# EAGLE design PENAMPUNG URIN (EAGLE 9.2.0)
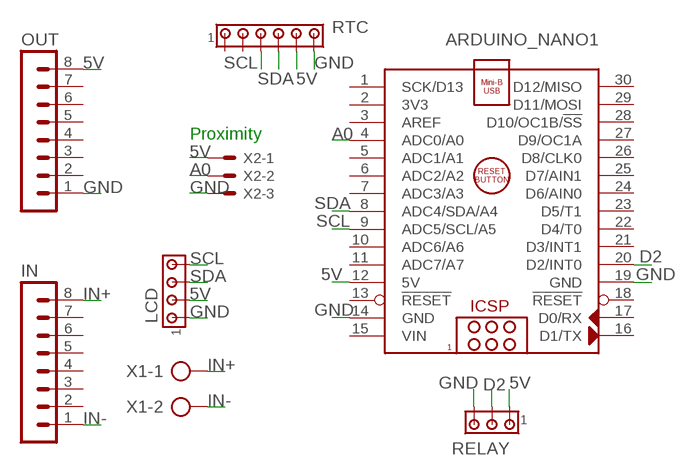
[diagram p0: schematic, sheet 1]

## Parts
ARDUINO_NANO1  ARDUINO_NANO  [ARDUINO_NANO]
IN  MA08-1  [MA08-1]
LCD  MTA04-100  [10X04MTA]
OUT  MA08-1  [MA08-1]
RELAY  MTA03-100  [10X03MTA]
RTC  MTA06-100  [10X06MTA]
X1  AK500/2-H  [AK500/2-H]
X2  KK-156-3  [KK-156-3]

## Nets
5V: ARDUINO_NANO1.12(5V) LCD.2 OUT.8 RELAY.1 RTC.5 X2.1
A0: ARDUINO_NANO1.4(ADC0/A0) X2.2
D2: ARDUINO_NANO1.20(D2/INT0) RELAY.2
GND: ARDUINO_NANO1.14(GND) ARDUINO_NANO1.19(GND) LCD.1 OUT.1 RELAY.3 RTC.6 X2.3
IN+: IN.8 X1.1
IN-: IN.1 X1.2
SCL: ARDUINO_NANO1.9(ADC5/SCL/A5) LCD.4 RTC.3
SDA: ARDUINO_NANO1.8(ADC4/SDA/A4) LCD.3 RTC.4
Unconnected: ARDUINO_NANO1.1(SCK/D13) ARDUINO_NANO1.2(3V3) ARDUINO_NANO1.3(AREF) ARDUINO_NANO1.5(ADC1/A1) ARDUINO_NANO1.6(ADC2/A2) ARDUINO_NANO1.7(ADC3/A3) ARDUINO_NANO1.10(ADC6/A6) ARDUINO_NANO1.11(ADC7/A7) ARDUINO_NANO1.13(!RESET) ARDUINO_NANO1.16(D1/TX) ARDUINO_NANO1.17(D0/RX) ARDUINO_NANO1.18(!RESET) ARDUINO_NANO1.21(D3/INT1) ARDUINO_NANO1.22(D4/T0) ARDUINO_NANO1.23(D5/T1) ARDUINO_NANO1.24(D6/AIN0) ARDUINO_NANO1.25(D7/AIN1) ARDUINO_NANO1.26(D8/CLK0) ARDUINO_NANO1.27(D9/OC1A) ARDUINO_NANO1.28(D10/OC1B/!SS) ARDUINO_NANO1.29(D11/MOSI) ARDUINO_NANO1.30(D12/MISO) IN.2 IN.3 IN.4 IN.5 IN.6 IN.7 OUT.2 OUT.3 OUT.4 OUT.5 OUT.6 OUT.7 RTC.1 RTC.2

## Notes on the sheet
- Proximity

## Power pins joined to a net without a drawn wire
VIN: ARDUINO_NANO1.15(VIN)

## Library data of the parts
ARDUINO_NANO1 = ArduinoNanoV30:ARDUINO_NANO: Arduino Nano V3.0 Module Overview: The Arduino Nano is a small, complete, and breadboard-friendly board based on the ATmega328 (Arduino Nano 3.x) or ATmega168 (Arduino Nano 2.x). It has more or less the same functionality of the Arduino Duemilanove, but in a different package. It lacks only a DC power jack, and works with a Mini-B USB cable instead of a standard one. The Nano was designed and is being produced by Gravitech <http://www.gravitech.us/arna30wiatp.html>. General specifications: Item Value Microcontroller Atmel ATmega168 or ATmega328 Operating Voltage (logic level) 5 V Input Voltage (recommended) 7-12 V Input Voltage (limits) 6-20 V Digital I/O Pins 14 (of which 6 provide PWM output) Analog Input Pins 8 DC Current per I/O Pin 40 mA Flash Memory 16 KB (ATmega168) or 32 KB (ATmega328) of which 2 KB used by bootloader SRAM 1 KB (ATmega168) or 2 KB (ATmega328) EEPROM 512 bytes (ATmega168) or 1 KB (ATmega328) Clock Speed 16 MHz Dimensions (Inches) 0.73" x 1.70" Dimensions (mm) 18mm x 45mm Overall height About 9 mm (not including pins) Weigth 5 g Power: The Arduino Nano can be powered via the Mini-B USB connection, 6-20V unregulated external power supply (pin 30), or 5V regulated external power supply (pin 27). The power source is automatically selected to the highest voltage source. Memory: The ATmega168 has 16 KB of flash memory for storing code (of which 2 KB is used for the bootloader); the ATmega328 has 32 KB, (also with 2 KB used for the bootloader). The ATmega168 has 1 KB of SRAM and 512 bytes of EEPROM (which can be read and written with the EEPROM library); the ATmega328 has 2 KB of SRAM and 1 KB of EEPROM. Input and Output: Each of the 14 digital pins on the Nano can be used as an input or output, using pinMode(), digitalWrite(), and digitalRead() functions. They operate at 5 volts. Each pin can provide or receive a maximum of 40 mA and has an internal pull-up resistor (disconnected by default) of 20-50 kOhms. In addition, some pins have specialized functions. Visit Arduino - ArduinoBoardNano <https://www.arduino.cc/en/Main/ArduinoBoardNano>
IN OUT = con-lstb:MA08-1: PIN HEADER; OC_FARNELL: unknown; OC_NEWARK: unknown
LCD = con-amp:MTA04-100: AMP connector
RELAY = con-amp:MTA03-100: AMP connector
RTC = con-amp:MTA06-100: AMP connector Connection corrected 2014-09-19
X1 = con-ptr500:AK500/2-H: CONNECTOR Aug. 2004 / PTR Meßtechnik: Die Bezeichnung der Serie AK505 wurde geändert. Es handelt sich hierbei um AK500 in horizontaler Ausführung.; OC_FARNELL: unknown; OC_NEWARK: unknown
X2 = con-molex:KK-156-3: KK 156 HEADER Source: http://www.molex.com/pdm_docs/sd/026604100_sd.pdf; MF: MOLEX; OC_FARNELL: unknown; OC_NEWARK: unknown

## Board
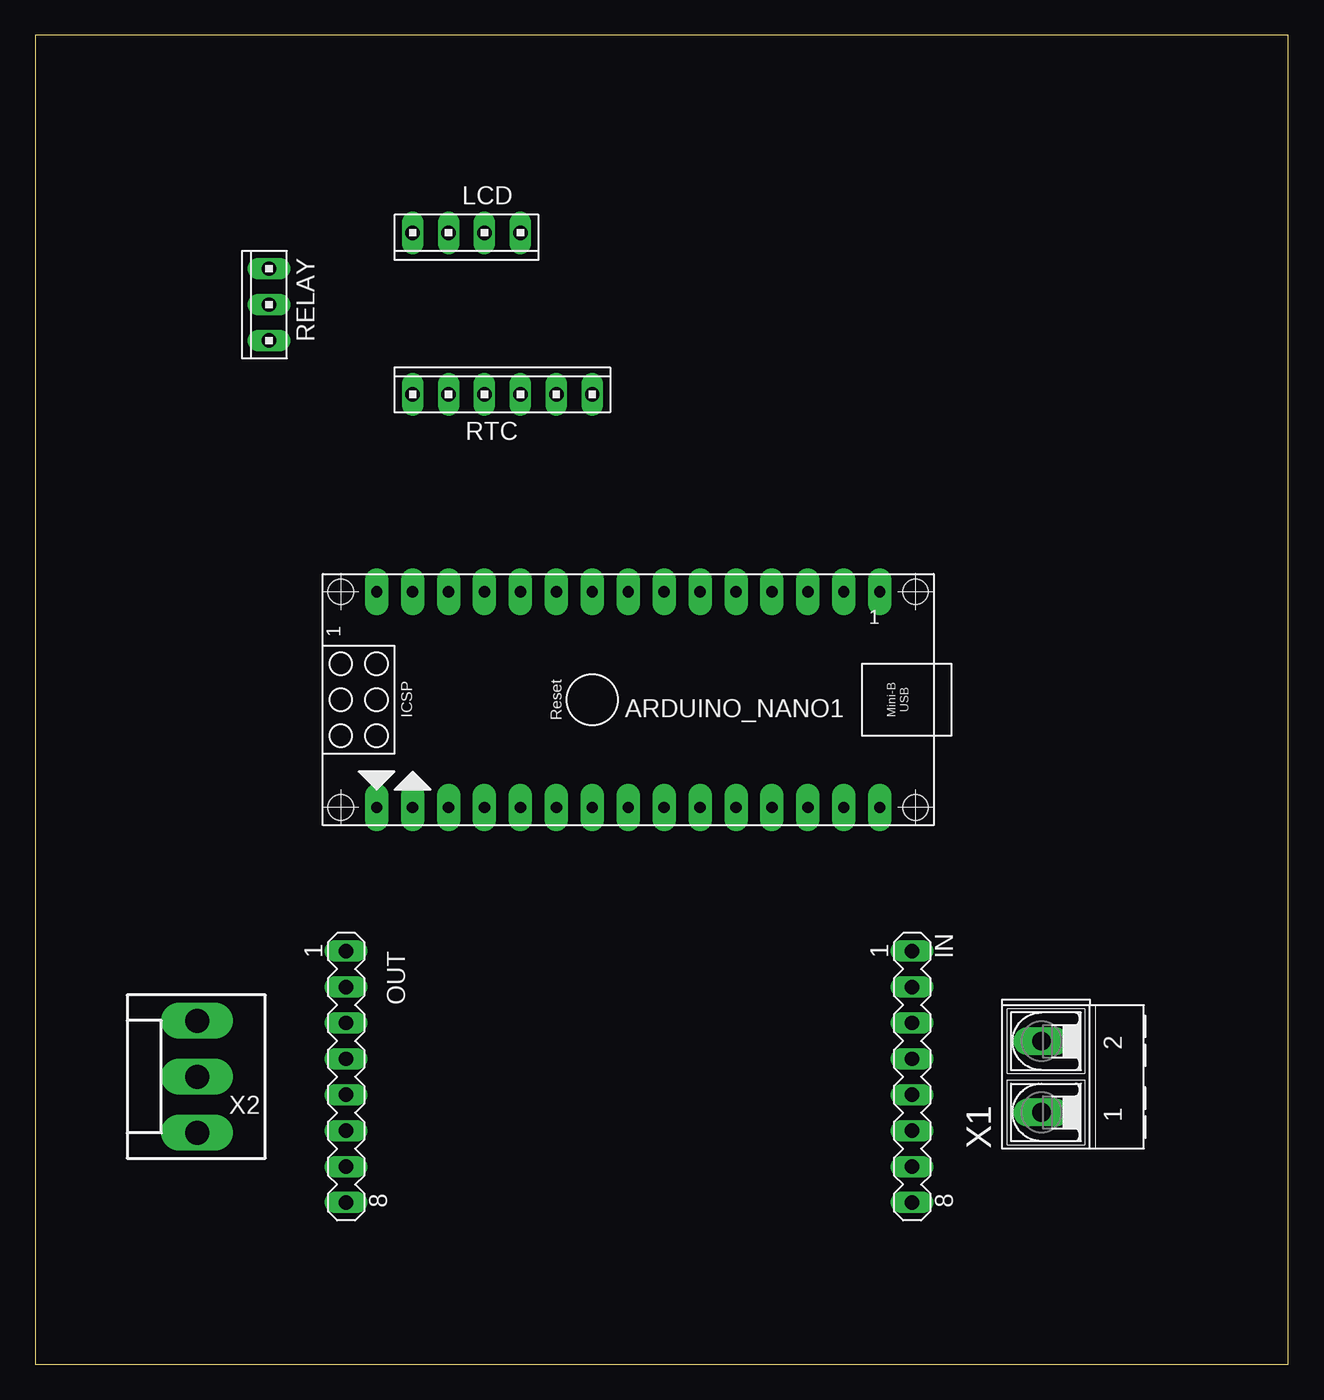
[diagram p1: board, top side]
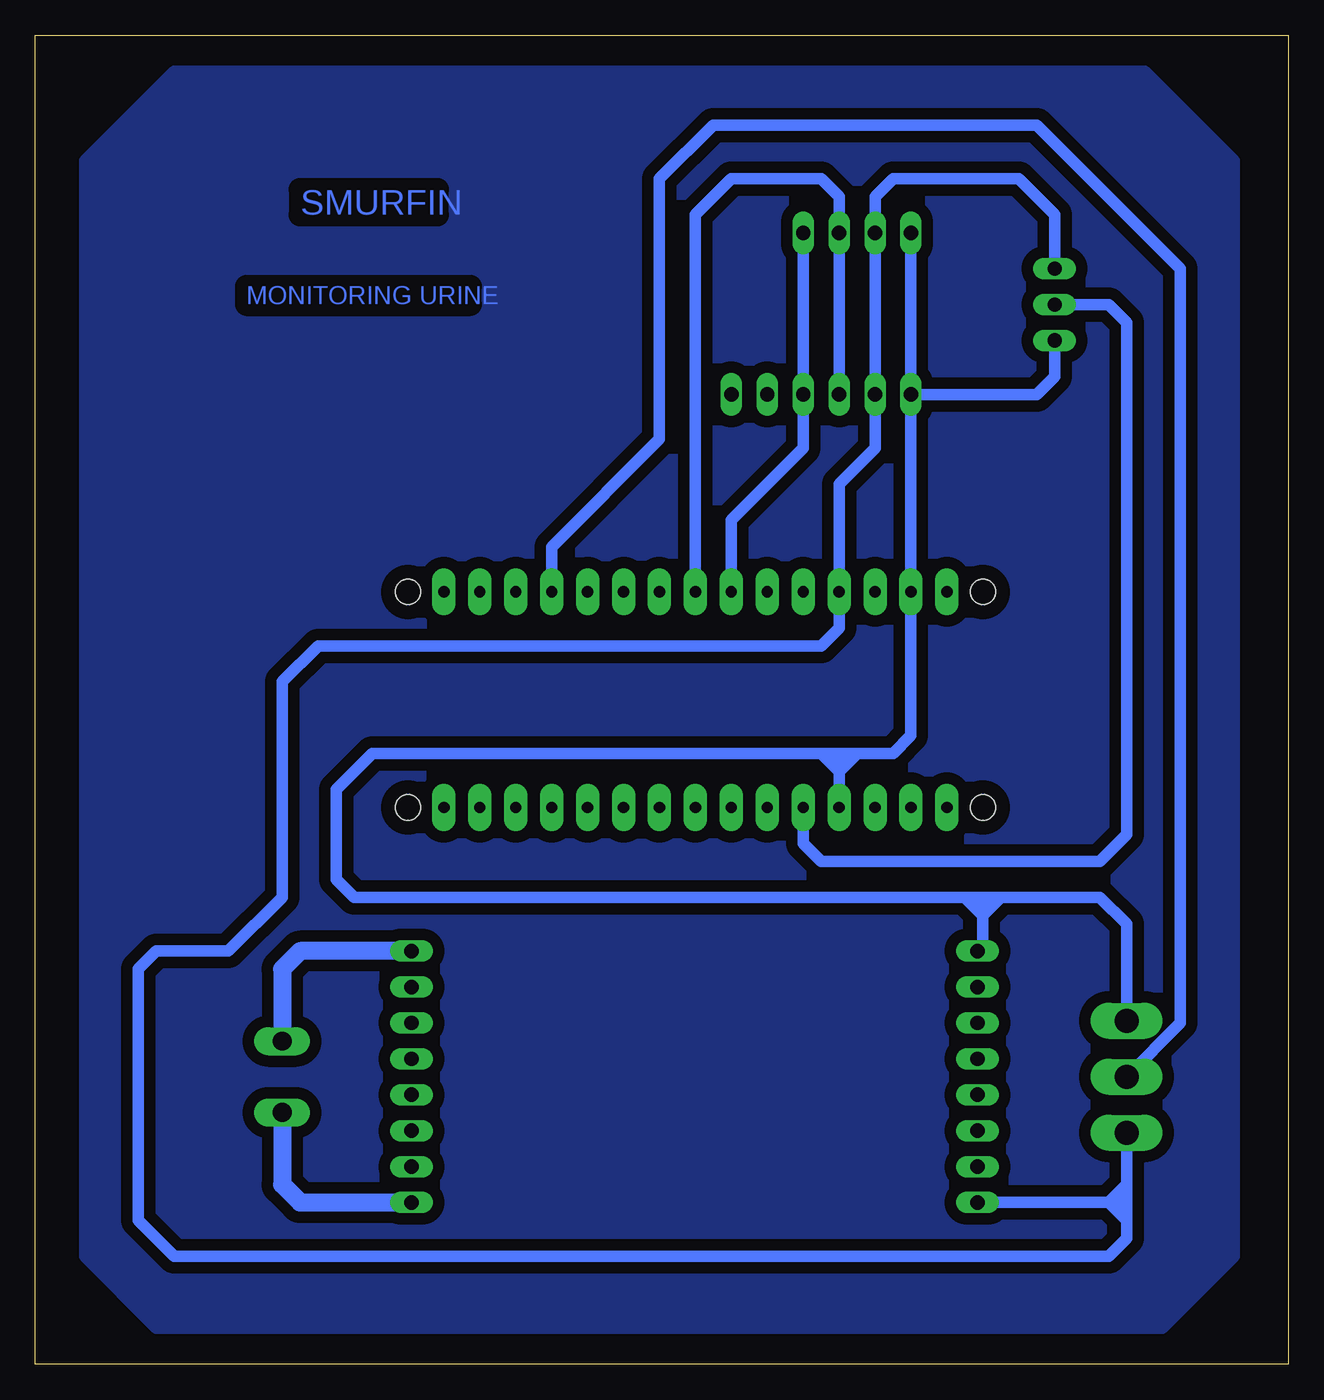
[diagram p2: board, bottom side, seen from below]

Size 88.57 x 93.97 mm. Coordinates in mm from the lower left corner, seen from the top.
Outline: 0,0 88.57,0 88.57,93.97 0,93.97 0,0
Copper layers (1*16): Top 0.035mm / dielectric 1.5mm / Bottom 0.035mm
Design rules "default": minimum track width 6mil, minimum drill 0.35mm, track to track 6mil, track to pad 6mil, pad to pad 6mil, via to via 6mil, smd to smd 6mil, copper to edge 40mil, drill to drill 6mil, minimum pad ring 10mil, minimum via ring 8mil, stop-mask expansion 4mil, vias tented up to drill 0mil, thermal gap 10mil

### Footprints (pad centres in the part's own frame; a part is rotated, then mirrored left to right if it is on the bottom)
ARDUINO_NANO = drill 0.8 pad 1.676 long: 1 -20.32,-7.62; 2 -17.78,-7.62; 3 -15.24,-7.62; 4 -12.7,-7.62; 5 -10.16,-7.62; 6 -7.62,-7.62; 7 -5.08,-7.62; 8 -2.54,-7.62; 9 0,-7.62; 10 2.54,-7.62; 11 5.08,-7.62; 12 7.62,-7.62; 13 10.16,-7.62; 14 12.7,-7.62; 15 15.24,-7.62; 16 15.24,7.62; 17 12.7,7.62; 18 10.16,7.62; 19 7.62,7.62; 20 5.08,7.62; 21 2.54,7.62; 22 0,7.62; 23 -2.54,7.62; 24 -5.08,7.62; 25 -7.62,7.62; 26 -10.16,7.62; 27 -12.7,7.62; 28 -15.24,7.62; 29 -17.78,7.62; 30 -20.32,7.62 | hole 1.778: -22.86,-7.62; -22.86,7.62; 17.78,7.62; 17.78,-7.62
MA08-1 = drill 1.016 long: 1 -8.89,0; 2 -6.35,0; 3 -3.81,0; 4 -1.27,0; 5 1.27,0; 6 3.81,0; 7 6.35,0; 8 8.89,0
10X04MTA = drill 1.016 long: 1 3.81,0; 2 1.27,0; 3 -1.27,0; 4 -3.81,0
10X03MTA = drill 1.016 long: 1 2.54,0; 2 0,0; 3 -2.54,0
10X06MTA = drill 1.016 long: 1 6.35,0; 2 3.81,0; 3 1.27,0; 4 -1.27,0; 5 -3.81,0; 6 -6.35,0
AK500/2-H = drill 1.321 long: 1 -2.515,0; 2 2.515,0
KK-156-3 = drill 1.7 pad 2.184 long: 1 -3.96,0; 2 0,0; 3 3.96,0

### Placement (x,y rotation side)
ARDUINO_NANO1  39.37,46.99 180 top
IN  61.98,20.32 270 top
LCD  30.48,80.01 180 top
OUT  21.97,20.32 270 top
RELAY  16.51,74.93 90 top
RTC  33.02,68.58 0 top
X1  71.12,20.32 90 top
X2  11.43,20.32 90 top

### Tracks (layer width: path | path; a pad name or v marks a point on that pad's centre or on a via)
5V
  Bottom 0.813: 11.43,15.24 X2.1 11.43,12.7 | RELAY.1 16.51,81.28 19.05,83.82 27.94,83.82 29.21,82.55 LCD.2 RTC.5 29.21,64.77 31.75,62.23 ARDUINO_NANO1.12 31.75,52.07 33.02,50.8 68.58,50.8 71.12,48.26 71.12,33.02 74.93,29.21 80.01,29.21 81.28,27.94 81.28,10.16 78.74,7.62 12.7,7.62 11.43,8.89 11.43,10.16 | 11.43,12.7 11.43,11.43 | 11.43,11.43 11.43,10.16 | 11.43,11.43 12.7,11.43 | 12.7,11.43 OUT.8 | 11.43,12.7 12.7,11.43 | 12.7,11.43 11.43,10.16
A0
  Bottom 0.813: X2.2 7.62,24.13 7.62,77.47 17.78,87.63 40.64,87.63 44.45,83.82 44.45,65.41 52.07,57.79 ARDUINO_NANO1.4
D2
  Bottom 0.813: ARDUINO_NANO1.20 34.29,36.83 33.02,35.56 13.33,35.56 11.43,37.46 11.43,73.66 12.7,74.93 RELAY.2
GND
  Bottom 0.813: LCD.1 RTC.6 | RTC.6 ARDUINO_NANO1.14 26.67,44.45 27.94,43.18 30.48,43.18 | ARDUINO_NANO1.19 31.75,41.91 | 31.75,43.18 31.75,41.91 | 20.32,33.02 13.31,33.02 11.43,31.14 X2.3 | 20.32,33.02 21.59,33.02 | 31.75,43.18 33.02,43.18 | 33.02,43.18 64.77,43.18 67.31,40.64 67.31,34.29 66.04,33.02 22.86,33.02 | RTC.6 17.78,68.58 16.51,69.85 RELAY.3 | 21.59,33.02 22.86,33.02 | 31.75,43.18 30.48,43.18 | 30.48,43.18 31.75,41.91 | 31.75,41.91 33.02,43.18 | OUT.1 21.59,29.59 21.59,31.75 | 21.59,33.02 21.59,31.75 | 20.32,33.02 21.59,31.75 | 21.59,31.75 22.86,33.02
GND.
  pour Bottom (isolate 0.813): 3.81,85.09 10.16,91.44 78.74,91.44 85.09,85.09 85.09,7.62 80.01,2.54 8.89,2.54 3.81,7.62
IN+
  Bottom 1.27: X1.1 71.12,12.7 69.85,11.43 IN.8
IN-
  Bottom 1.27: X1.2 71.12,27.94 69.85,29.21 IN.1
SCL
  Bottom 0.813: LCD.4 RTC.3 34.29,64.77 39.37,59.69 ARDUINO_NANO1.9
SDA
  Bottom 0.813: RTC.4 LCD.3 31.75,82.55 33.02,83.82 39.37,83.82 41.91,81.28 ARDUINO_NANO1.8

### Text on the board
Bottom: SMURFIN | MONITORING URINE